# Altium schematic sheet MCU.SchDoc
size A4
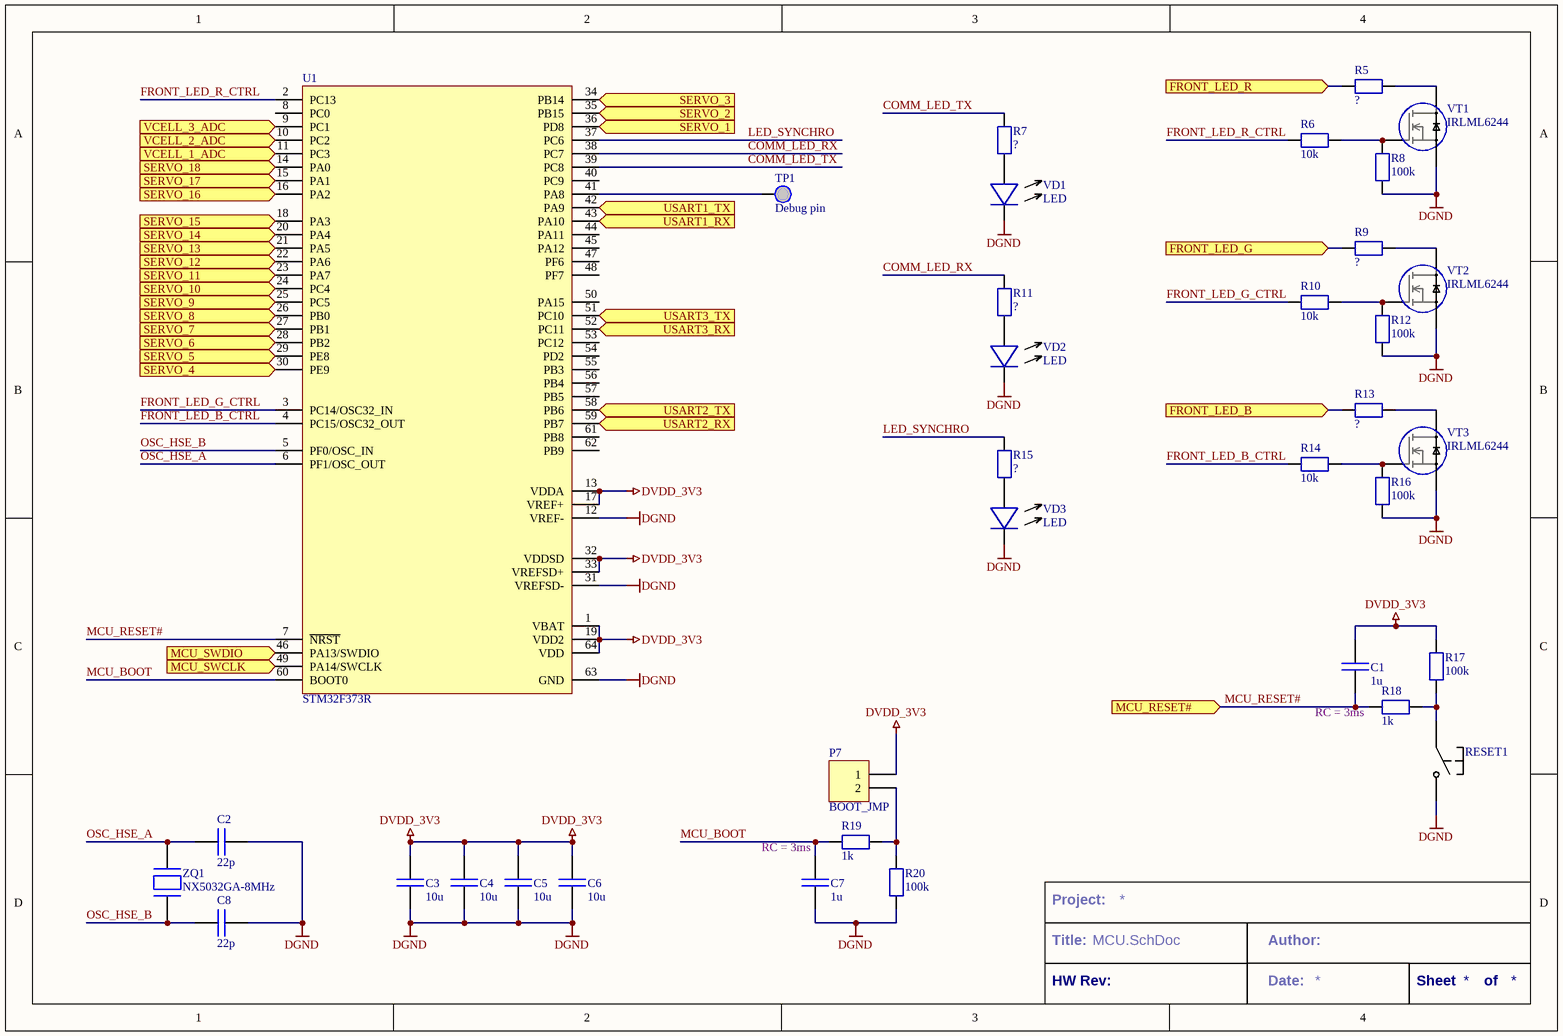
[diagram p0: MCU.SchDoc]

## Parts
C1  1u  [C_0603/1608]
C2  22p  [C_0603/1608]
C3  10u  [C_0603/1608]
C4  10u  [C_0603/1608]
C5  10u  [C_0603/1608]
C6  10u  [C_0603/1608]
C7  1u  [C_0603/1608]
C8  22p  [C_0603/1608]
P7  BOOT_JMP  [HDR_SMD_1X2_1.50]
R5  ?  [R_0603/1608]
R6  10k  [R_0603/1608]
R7  ?  [R_0603/1608]
R8  100k  [R_0603/1608]
R9  ?  [R_0603/1608]
R10  10k  [R_0603/1608]
R11  ?  [R_0603/1608]
R12  100k  [R_0603/1608]
R13  ?  [R_0603/1608]
R14  10k  [R_0603/1608]
R15  ?  [R_0603/1608]
R16  100k  [R_0603/1608]
R17  100k  [R_0603/1608]
R18  1k  [R_0603/1608]
R19  1k  [R_0603/1608]
R20  100k  [R_0603/1608]
RESET1  Button SPST  [BUTTON_SMD_6x6]  (value not drawn)
TP1  Debug pin  [TP_SMD_D1.00]  (no BOM)
U1  STM32F373R  [LQFP64]
VD1  LED  [LED_0603/1608]
VD2  LED  [LED_0603/1608]
VD3  LED  [LED_0603/1608]
VT1  IRLML6244  [SOT23-3]
VT2  IRLML6244  [SOT23-3]
VT3  IRLML6244  [SOT23-3]
ZQ1  NX5032GA-8MHz  [OSC_2PINS SMD]

## Ports
FRONT_LED_B, FRONT_LED_G, FRONT_LED_R, MCU_RESET#, MCU_SWCLK, MCU_SWDIO, SERVO_1, SERVO_2, SERVO_3, SERVO_4, SERVO_5, SERVO_6, SERVO_7, SERVO_8, SERVO_9, SERVO_10, SERVO_11, SERVO_12, SERVO_13, SERVO_14, SERVO_15, SERVO_16, SERVO_17, SERVO_18, USART1_RX, USART1_TX, USART2_RX, USART2_TX, USART3_RX, USART3_TX, VCELL_1_ADC, VCELL_2_ADC, VCELL_3_ADC

## Nets
DGND: C2.2 C3.2 C4.2 C5.2 C6.2 C7.2 C8.2 R8.1 R12.1 R16.1 R20.2 RESET1.2 U1.12(VREF-) U1.31(VREFSD-) U1.63(GND) VD1.C(Cathode) VD2.C(Cathode) VD3.C(Cathode) VT1.S VT2.S VT3.S
DVDD_3V3: C1.1 C3.1 C4.1 C5.1 C6.1 P7.1 R17.1 U1.1(VBAT) U1.13(VDDA) U1.17(VREF+) U1.19(VDD2) U1.32(VDDSD) U1.33(VREFSD+) U1.64(VDD)
COMM_LED_RX: R11.1 U1.38(PC7)
COMM_LED_TX: R7.1 U1.39(PC8)
FRONT_LED_B: R13.2 ; port FRONT_LED_B
FRONT_LED_B_CTRL: R14.2 U1.4(PC15/OSC32_OUT)
FRONT_LED_G: R9.2 ; port FRONT_LED_G
FRONT_LED_G_CTRL: R10.2 U1.3(PC14/OSC32_IN)
FRONT_LED_R: R5.2 ; port FRONT_LED_R
FRONT_LED_R_CTRL: R6.2 U1.2(PC13)
LED_SYNCHRO: R15.1 U1.37(PC6)
MCU_BOOT: C7.1 R19.2 U1.60(BOOT0)
MCU_RESET#: C1.2 R18.2 U1.7(~{NRST}) ; port MCU_RESET#
MCU_SWCLK: U1.49(PA14/SWCLK) ; port MCU_SWCLK
MCU_SWDIO: U1.46(PA13/SWDIO) ; port MCU_SWDIO
OSC_HSE_A: C2.1 U1.6(PF1/OSC_OUT) ZQ1.2
OSC_HSE_B: C8.1 U1.5(PF0/OSC_IN) ZQ1.1
SERVO_1: U1.36(PD8) ; port SERVO_1
SERVO_2: U1.35(PB15) ; port SERVO_2
SERVO_3: U1.34(PB14) ; port SERVO_3
SERVO_4: U1.30(PE9) ; port SERVO_4
SERVO_5: U1.29(PE8) ; port SERVO_5
SERVO_6: U1.28(PB2) ; port SERVO_6
SERVO_7: U1.27(PB1) ; port SERVO_7
SERVO_8: U1.26(PB0) ; port SERVO_8
SERVO_9: U1.25(PC5) ; port SERVO_9
SERVO_10: U1.24(PC4) ; port SERVO_10
SERVO_11: U1.23(PA7) ; port SERVO_11
SERVO_12: U1.22(PA6) ; port SERVO_12
SERVO_13: U1.21(PA5) ; port SERVO_13
SERVO_14: U1.20(PA4) ; port SERVO_14
SERVO_15: U1.18(PA3) ; port SERVO_15
SERVO_16: U1.16(PA2) ; port SERVO_16
SERVO_17: U1.15(PA1) ; port SERVO_17
SERVO_18: U1.14(PA0) ; port SERVO_18
USART1_RX: U1.43(PA10) ; port USART1_RX
USART1_TX: U1.42(PA9) ; port USART1_TX
USART2_RX: U1.59(PB7) ; port USART2_RX
USART2_TX: U1.58(PB6) ; port USART2_TX
USART3_RX: U1.52(PC11) ; port USART3_RX
USART3_TX: U1.51(PC10) ; port USART3_TX
VCELL_1_ADC: U1.11(PC3) ; port VCELL_1_ADC
VCELL_2_ADC: U1.10(PC2) ; port VCELL_2_ADC
VCELL_3_ADC: U1.9(PC1) ; port VCELL_3_ADC
NetP7_2: P7.2 R19.1 R20.1
NetR5_1: R5.1 VT1.D
NetR6_1: R6.1 R8.2 VT1.G
NetR7_2: R7.2 VD1.A(Anode)
NetR9_1: R9.1 VT2.D
NetR10_1: R10.1 R12.2 VT2.G
NetR11_2: R11.2 VD2.A(Anode)
NetR13_1: R13.1 VT3.D
NetR14_1: R14.1 R16.2 VT3.G
NetR15_2: R15.2 VD3.A(Anode)
NetR17_2: R17.2 R18.1 RESET1.1
NetTP1_1: TP1.1 U1.41(PA8)

Not connected (* = marked no-connect by the designer): U1 0(EP) 8(PC0) 40(PC9) 44(PA11) 45(PA12) 47(PF6) 48(PF7) 50(PA15) 53(PC12) 54(PD2) 55(PB3) 56(PB4) 57(PB5) 61(PB8) 62(PB9)

## Notes on the sheet
- (near R18) RC = 3ms
- RC = 3ms
- Project:
- Title:
- HW Rev:
- Author:
- Date:
- Sheet
- of

## Library data of the parts
C1-C8 = Capacitor: Non-polarized capacitor
P7 = Header 2: Header, 2-Pin; LatestRevisionDate: 17-Jul-2002; LatestRevisionNote: Re-released for DXP Platform.; Publisher: Altium Limited
R5-R20 = Resistor
RESET1 = Button SPST: Button SPST, without fixation
TP1 = Test point
U1 = STM32F373R: 32-bit Cortex-M3
VT1-VT3 = MOSFET N: pin to pad: D>3 G>1 S>2
ZQ1 = Crystal oscillator